# Altium project EvoHD_Lite.PrjPcb
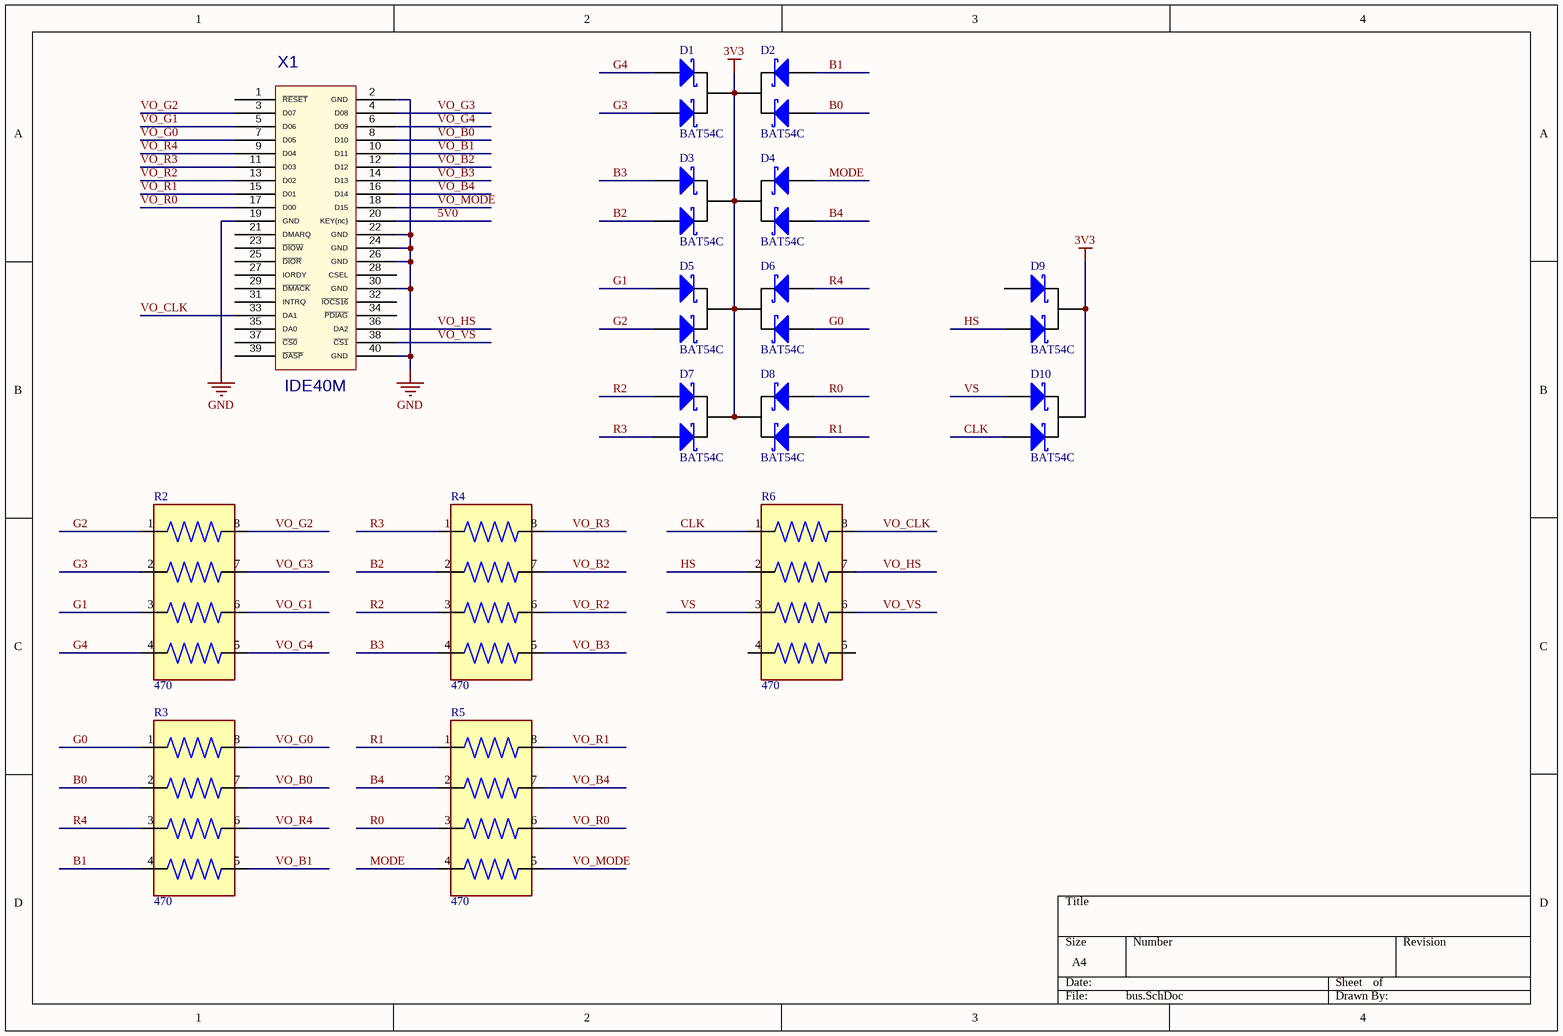
[diagram p0: bus.SchDoc]
2 sheets, 20 parts. Net scope: global (net labels, ports and power ports of the same name join across sheets).
Board file: EvoHD_Lite_RevA.PcbDoc
Sheets:
  bus.SchDoc
  hdmi.SchDoc

## Sheet bus.SchDoc
size A4

### Parts
D1  BAT54C  [SOT-23]
D2  BAT54C  [SOT-23]
D3  BAT54C  [SOT-23]
D4  BAT54C  [SOT-23]
D5  BAT54C  [SOT-23]
D6  BAT54C  [SOT-23]
D7  BAT54C  [SOT-23]
D8  BAT54C  [SOT-23]
D9  BAT54C  [SOT-23]
D10  BAT54C  [SOT-23]
R2  470  [RESCAV50P200X100X55-8N]
R3  470  [RESCAV50P200X100X55-8N]
R4  470  [RESCAV50P200X100X55-8N]
R5  470  [RESCAV50P200X100X55-8N]
R6  470  [RESCAV50P200X100X55-8N]
X1  IDE40M  [IDE40M]

### Nets
3V3: D1.3(C) D2.3(C) D3.3(C) D4.3(C) D5.3(C) D6.3(C) D7.3(C) D8.3(C) D9.3(C) D10.3(C)
5V0: X1.20(KEY(nc))
GND: X1.2(GND) X1.19(GND) X1.22(GND) X1.24(GND) X1.26(GND) X1.30(GND) X1.40(GND)
B0: D2.2(A) R3.2
B1: D2.1(A) R3.4
B2: D3.2(A) R4.2
B3: D3.1(A) R4.4
B4: D4.2(A) R5.2
CLK: D10.2(A) R6.1
G0: D6.2(A) R3.1
G1: D5.1(A) R2.3
G2: D5.2(A) R2.1
G3: D1.2(A) R2.2
G4: D1.1(A) R2.4
HS: D9.2(A) R6.2
MODE: D4.1(A) R5.4
R0: D8.1(A) R5.3
R1: D8.2(A) R5.1
R2: D7.1(A) R4.3
R3: D7.2(A) R4.1
R4: D6.1(A) R3.3
VO_B0: R3.7 X1.8(D10)
VO_B1: R3.5 X1.10(D11)
VO_B2: R4.7 X1.12(D12)
VO_B3: R4.5 X1.14(D13)
VO_B4: R5.7 X1.16(D14)
VO_CLK: R6.8 X1.33(DA1)
VO_G0: R3.8 X1.7(D05)
VO_G1: R2.6 X1.5(D06)
VO_G2: R2.8 X1.3(D07)
VO_G3: R2.7 X1.4(D08)
VO_G4: R2.5 X1.6(D09)
VO_HS: R6.7 X1.36(DA2)
VO_MODE: R5.5 X1.18(D15)
VO_R0: R5.6 X1.17(D00)
VO_R1: R5.8 X1.15(D01)
VO_R2: R4.6 X1.13(D02)
VO_R3: R4.8 X1.11(D03)
VO_R4: R3.6 X1.9(D04)
VO_VS: R6.6 X1.38(~{CS1})
VS: D10.1(A) R6.3

Not connected (* = marked no-connect by the designer): D9 1(A); R6 4 5; X1 1(~{RESET}) 21(DMARQ) 23(~{DIOW}) 25(~{DIOR}) 27(IORDY) 28(CSEL) 29(~{DMACK}) 31(INTRQ) 32(~{IOCS16}) 34(~{PDIAG}) 35(DA0) 37(~{CS0}) 39(~{DASP})

### Library data of the parts
R2-R6 = CAT10-***4LF: *** Ohm Â±5% 62.5mW Power Per Element Isolated Resistor Network/Array Â±250ppm/Â°C 0804, Concave, Long Side Terminals; MP: CAT10-101J4LF; Package: None; Price: None; Value: 470; Availability: Unavailable
X1 = IDE40M: Value: *

## Sheet hdmi.SchDoc
size A4
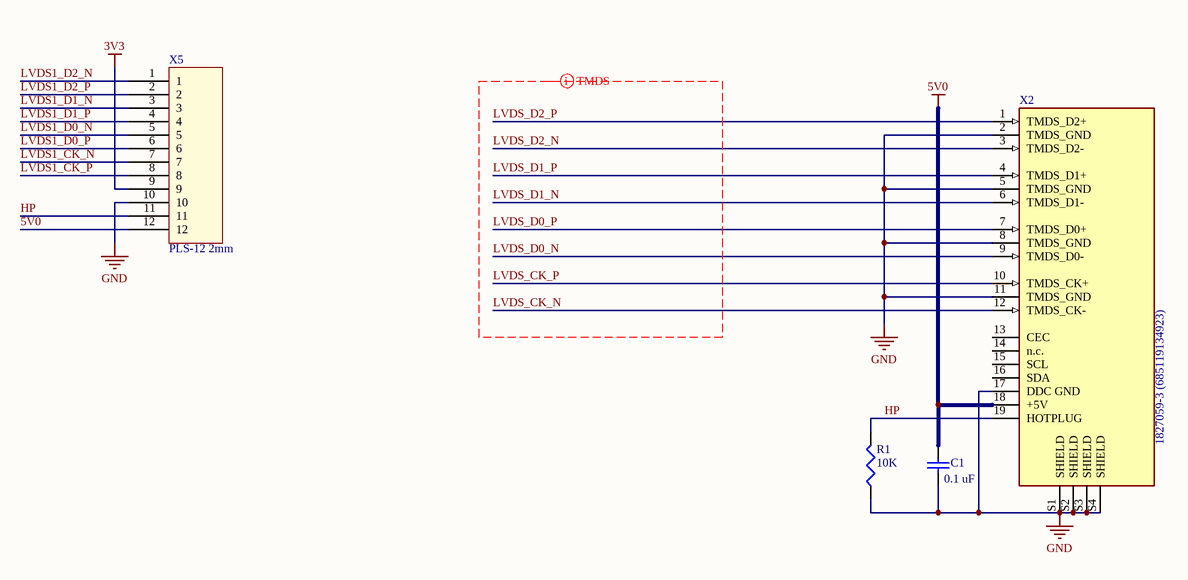
[diagram p1: hdmi.SchDoc]

### Parts
C1  0.1 uF  [0805 chip cap]
R1  10K  [0805 CHIP RES]
X2  1827059-3 (685119134923)  [1827059-3 (685119134923)]
X5  PLS-12 2mm  [PLS-12 2MM]

### Nets
3V3: X5.9
5V0: C1.2 X2.18(+5V) X5.12
GND: C1.1 R1.1 X2.2(TMDS_GND) X2.5(TMDS_GND) X2.8(TMDS_GND) X2.11(TMDS_GND) X2.17(DDC_GND) X2.S1(SHIELD) X2.S2(SHIELD) X2.S3(SHIELD) X2.S4(SHIELD) X5.10
HP: R1.2 X2.19(HOTPLUG) X5.11
LVDS1_CK_N: X5.7
LVDS1_CK_P: X5.8
LVDS1_D0_N: X5.5
LVDS1_D0_P: X5.6
LVDS1_D1_N: X5.3
LVDS1_D1_P: X5.4
LVDS1_D2_N: X5.1
LVDS1_D2_P: X5.2
LVDS_CK_N: X2.12(TMDS_CK-)
LVDS_CK_P: X2.10(TMDS_CK+)
LVDS_D0_N: X2.9(TMDS_D0-)
LVDS_D0_P: X2.7(TMDS_D0+)
LVDS_D1_N: X2.6(TMDS_D1-)
LVDS_D1_P: X2.4(TMDS_D1+)
LVDS_D2_N: X2.3(TMDS_D2-)
LVDS_D2_P: X2.1(TMDS_D2+)

Not connected (* = marked no-connect by the designer): X2 13(CEC) 14(n.c.) 15(SCL) 16(SDA)

### Layout directives
differential pair; differential pair class TDMS_DIFF; net class TDMS: LVDS_CK_N, LVDS_CK_P, LVDS_D0_N, LVDS_D0_P, LVDS_D1_N, LVDS_D1_P, LVDS_D2_N, LVDS_D2_P

### Library data of the parts
C1 = Cap: Capacitor; Value: 0.1 uF
R1 = CHIP RES: Resistor; Value: 10K
X2 = 1827059-3 (685119134923): HDMI Connector | Right Angle | Without Flange | -20C to 85C / 1827059-3 / KLS1-285-1-N-1-R / 1747981-1 / 685119134923; MP: SS-53000-001; MF: Stewart Connector; Price: None; SnapEDA_Link: https://www.snapeda.com/parts/SS-53000-001/Stewart%20Connector/view-part/4628816/?ref=snap; Availability: Unavailable; Value: *; Package: None

## Nets that join several sheets
3V3: bus (10 pins), hdmi (X5.9)
5V0: bus (X1.20), hdmi (C1.2 X2.18 X5.12)
GND: bus (7 pins), hdmi (12 pins)